# Altium schematic sheet Power_Card.SchDoc
size Letter; SheetNumber: 1; SheetTotal: 5
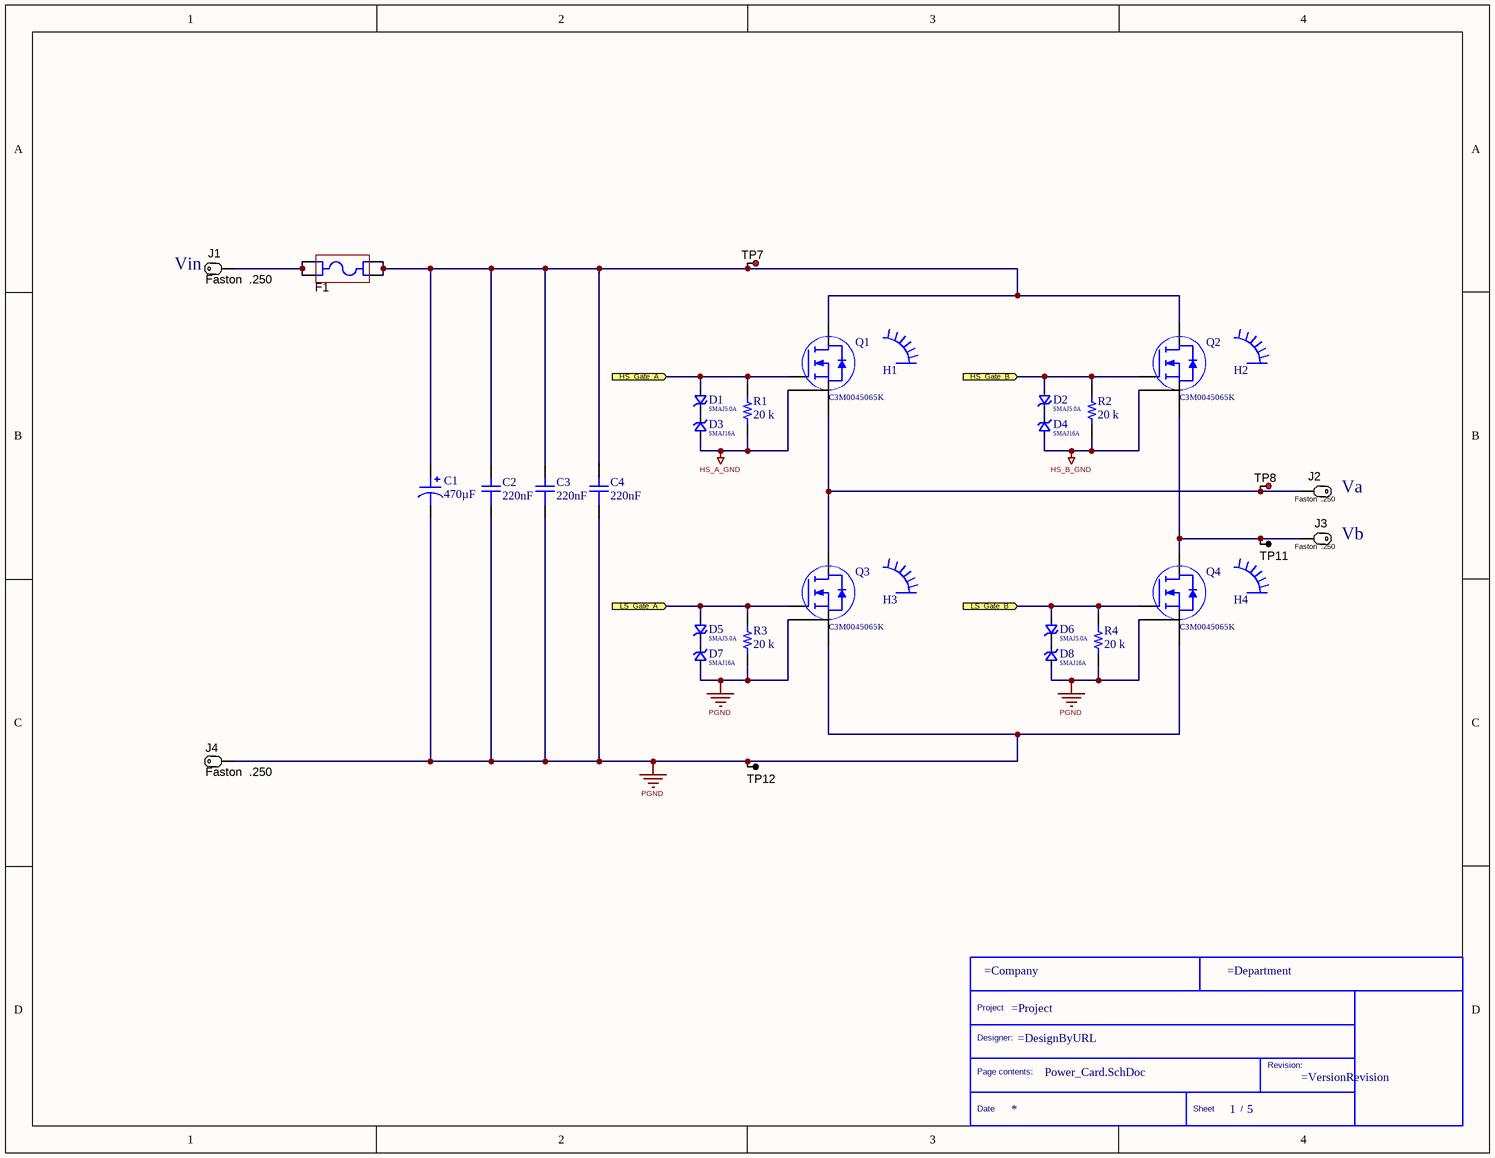
[diagram p0: Power_Card.SchDoc]

## Parts
*  TittleBlock  (value not drawn)  (graphical)
C1  470µF  [CAP TH ALUM ELEC D35.00mm S10.00mm H40.00mm]
C2  220nF  [R75PI32204030J]
C3  220nF  [R75PI32204030J]
C4  220nF  [R75PI32204030J]
D1  SMAJ5.0A  [DO214AC SMA]
D2  SMAJ5.0A  [DO214AC SMA]
D3  SMAJ16A  [DO214AC SMA]
D4  SMAJ16A  [DO214AC SMA]
D5  SMAJ5.0A  [DO214AC SMA]
D6  SMAJ5.0A  [DO214AC SMA]
D7  SMAJ16A  [DO214AC SMA]
D8  SMAJ16A  [DO214AC SMA]
F1  3101.0040  [SCHURTER_3101_0040]  (value not drawn)
H1  Disipador de 3.3.C/W  [HSINK_6399BG]  (value not drawn)
H2  Disipador de 3.3.C/W  [HSINK_6399BG]  (value not drawn)
H3  Disipador de 3.3.C/W  [HSINK_6399BG]  (value not drawn)
H4  Disipador de 3.3.C/W  [HSINK_6399BG]  (value not drawn)
J1  Faston  .250  [TE_62409-1]
J2  Faston  .250  [TE_62409-1]
J3  Faston  .250  [TE_62409-1]
J4  Faston  .250  [TE_62409-1]
Q1  C3M0045065K  [TO-247-4L_C3M0075120K_WFS]
Q2  C3M0045065K  [TO-247-4L_C3M0075120K_WFS]
Q3  C3M0045065K  [TO-247-4L_C3M0075120K_WFS]
Q4  C3M0045065K  [TO-247-4L_C3M0075120K_WFS]
R1  20 k  [RES 0603_1608]
R2  20 k  [RES 0603_1608]
R3  20 k  [RES 0603_1608]
R4  20 k  [RES 0603_1608]
TP7  5010  [Keystone5010]  (value not drawn)
TP8  5010  [Keystone5010]  (value not drawn)
TP11  5011  [Keystone5011]  (value not drawn)
TP12  5011  [Keystone5011]  (value not drawn)

## Ports
HS_Gate_A (in), HS_Gate_B (in), LS_Gate_A (in), LS_Gate_B (in)

## Nets
HS_A_GND: D3.2 Q1.3(S) R1.1
HS_B_GND: D4.2 Q2.3(S) R2.1
PGND: C1.2 C2.2 C3.2 C4.2 D7.2 D8.2 J4.1(P1) Q3.2(Power_Source) Q3.3(S) Q4.2(Power_Source) Q4.3(S) R3.1 R4.1 TP12.1
HS_Gate_A: D1.2 Q1.4(G) R1.2 ; port HS_Gate_A
HS_Gate_B: D2.2 Q2.4(G) R2.2 ; port HS_Gate_B
LS_Gate_A: D5.2 Q3.4(G) R3.2 ; port LS_Gate_A
LS_Gate_B: D6.2 Q4.4(G) R4.2 ; port LS_Gate_B
NetC1_1: C1.1 C2.1 C3.1 C4.1 F1.3 F1.4 Q1.1(D) Q2.1(D) TP7.1
NetD1_1: D1.1 D3.1
NetD2_1: D2.1 D4.1
NetD5_1: D5.1 D7.1
NetD6_1: D6.1 D8.1
NetF1_1: F1.1 F1.2 J1.1(P1)
NetJ2_1: J2.1(P1) Q1.2(Power_Source) Q3.1(D) TP8.1
NetJ3_1: J3.1(P1) Q2.2(Power_Source) Q4.1(D) TP11.1

## Notes on the sheet
- (near J1) Vin
- (near J2) Va
- Vb
- (in symbol TittleBlock) Project; Designer:; Page contents:; Revision:; Date; Sheet; /

## Library data of the parts
* = TittleBlock: Standard Title block
C1 = ESMQ451VSN471MA40S: CAP ALUM 470UF 20% 450V SNAP; Manufacturer: United Chemi-Con; Lifetime @ Temp.: 2000 Hrs @ 85°C; Polarization: Polar; Ripple Current @ High Frequency: 3.618A @ 50kHz; Ripple Current @ Low Frequency: 2.53A @ 120Hz; Part Number: ESMQ451VSN471MA40S; Applications: General Purpose; Capacitance: 470µF; ComponentLink1Description: Datasheet; ComponentLink1URL: http://www.chemi-con.co.jp/cgi-bin/CAT_DB/SEARCH/cat_db_al.cgi?e=e&j=p&pdfname=smqlug; ComponentLink2Description: DigiKey Link; ComponentLink2URL: http://digikey.com/product-detail/en/united-chemi-con/ESMQ451VSN471MA40S/565-2798-ND/758010; Device Package: Radial, Can - Snap-In; Height - Seated (Max): 1.575" (40.00mm); LastUpdated: 13/9/2020 09:22:08; Lead Spacing: 0.394" (10.00mm); Lifecycle Status: Active; Minimum Order: 1; Mounting Type: Through Hole; Operating Temperature: -25°C ~ 85°C; Package / Case: Radial, Can - Snap-In; Packaging: Bulk; PartId: 26446; Part Status: Active; Price: 5.99; Series: SMQ; Size / Dimension: 1.378" Dia (35.00mm); Supplier 1: DigiKey; Supplier Part Number 1: 565-2798-ND; Tolerance: ±20%; Value: 470µF; Voltage - Rated: 450V
C2-C4 = R75PI32204030J: KEMET         R75PI32204030J            Film Capacitor, AEC-Q200 R75 Series, 0.22 F,  5%, PP (Polypropylene), 630 V; Voltage Rating: 630V; Voltage Rating (AC): 250V; Dissipation Factor: 0.05%; Lead Diameter: 0.8mm; Lead Length: 30mm; Supplier 1: Digi-Key; Supplier Part Number 1: 399-12761-ND; Manufacturer: KEMET; Manufacturer Part Number: R75PI32204030J; RoHS: Yes; Category: Film Capacitors; Stock 1: 488; Pricing 1: 1=0,95000, 10=0,72000, 50=0,59800, 100=0,51490, 500=0,39860, 1000=0,34324, 2500=0,32110, 5000=0,31002 (USD); Mount: Through Hole; Case/Package: Radial; Dielectric Material: PP; Min Operating Temperature: -55°C; Max Operating Temperature: 105°C; Capacitance: 220nF; Tolerance: 5%; Packaging: Bulk; Voltage Rating (DC): 630V; Dielectric: PP; Termination: PC Pins; Voltage: 630V; Length: 0.709inch; Width: 0.394inch; Height: 16mm; Height - Seated (Max): 0.634inch; Lead Pitch: 15mm; Depth: 10mm; REACH SVHC: No SVHC; RoHS Compliant: Yes; ComponentLink1URL: http://www.alliedelec.com/m/d/0659d349de7ca29105b1b70da899f791.pdf?src-supplier=Allied+Electronics; ComponentLink1Description: http://www.alliedelec.com/m/d/0659d349de7ca29105b1b70da899f791.pdf?src-supplier=Allied+Electronics; ComponentLink2URL: http://www.farnell.com/datasheets/2120989.pdf?src-supplier=Farnell; ComponentLink2Description: http://www.farnell.com/datasheets/2120989.pdf?src-supplier=Farnell; ComponentLink3URL: http://www.kemet.com/docfinder?Partnumber=R75PI32204030J&src-supplier=Digi-Key; ComponentLink3Description: http://www.kemet.com/docfinder?Partnumber=R75PI32204030J&src-supplier=Digi-Key; ComponentLink4URL: http://www.farnell.com/datasheets/2068064.pdf?src-supplier=Element14; ComponentLink4Description: http://www.farnell.com/datasheets/2068064.pdf?src-supplier=Element14
D1 D2 D5 D6 = SMAJ5.0A: BOURNS - SMAJ5.0A - TVS Diode, SMAJ Series, Unidirectional, 5 V, 9.2 V, DO-214AC (SMA), 2 Pins; Max Power Dissipation: 400W; Number of Elements: 1; Max Surge Current: 40A; Reverse Breakdown Voltage: 6.4V; Breakdown Voltage: 7V; Reverse Standoff Voltage: 5V; Clamping Voltage: 9.2V; Test Current: 10mA; Peak Pulse Current: 43.5A; Element Configuration: Single; Leakage Current: 800uA; Operating Supply Voltage: 3.5V; Power Line Protection: No; Diode Type: ZENER; ESD Protection: Yes; Supplier 1: Digi-Key; Supplier Part Number 1: SMAJ5.0ABCT-ND; Manufacturer: Bourns; Manufacturer Part Number: SMAJ5.0A; RoHS: Yes; Category: TVS Diodes; Stock 1: 30981; Pricing 1: 1=0,49000, 10=0,34300, 100=0,17320, 500=0,14130, 1000=0,10483, 2000=0,08820 (USD); Mount: Surface Mount; Case/Package: DO-214AC; Number of Pins: 2; Min Operating Temperature: -55°C; Max Operating Temperature: 150°C; Packaging: Tape and Reel; Package Quantity: 1; Series: SMAJ; Polarity: Unidirectional; Direction: Unidirectional; Peak Pulse Power: 400W; Min Breakdown Voltage: 6.4V; Number of Channels: 1; Max Reverse Leakage Current: 800uA; Termination: SMD/SMT; Max Breakdown Voltage: 7V; Number of Unidirectional Channels: 1; Resistor Type: Zener; Length: 4.57mm; Width: 2.92mm; Height: 2.42mm; Radiation Hardening: No; RoHS Compliant: Yes; REACH SVHC: No SVHC; ComponentLink1URL: https://datasheet.ciiva.com/25624/0900766b8112213b-25624680.pdf?src-supplier=RSComponents; ComponentLink1Description: https://datasheet.ciiva.com/25624/0900766b8112213b-25624680.pdf?src-supplier=RSComponents; ComponentLink2URL: https://datasheet.ciiva.com/333/smaj-333521.pdf?src-supplier=Digi-Key; ComponentLink2Description: https://datasheet.ciiva.com/333/smaj-333521.pdf?src-supplier=Digi-Key; ComponentLink3URL: https://datasheet.ciiva.com/333/smaj-333522.pdf?src-supplier=Digi-Key; ComponentLink3Description: https://datasheet.ciiva.com/333/smaj-333522.pdf?src-supplier=Digi-Key; ComponentLink4URL: https://datasheet.ciiva.com/333/smaj-333523.pdf?src-supplier=Digi-Key; ComponentLink4Description: https://datasheet.ciiva.com/333/smaj-333523.pdf?src-supplier=Digi-Key; ComponentLink5URL: https://datasheet.ciiva.com/3021/smaj-3021400.pdf?src-supplier=Avnet; ComponentLink5Description: https://datasheet.ciiva.com/3021/smaj-3021400.pdf?src-supplier=Avnet; ComponentLink6URL: https://datasheet.ciiva.com/30169/smaj-30169929.pdf?src-supplier=Onlinecomponents.com; ComponentLink6Description: https://datasheet.ciiva.com/30169/smaj-30169929.pdf?src-supplier=Onlinecomponents.com; ComponentLink7URL: https://datasheet.ciiva.com/28409/1695388-28409916.pdf?src-supplier=Element14; ComponentLink7Description: https://datasheet.ciiva.com/28409/1695388-28409916.pdf?src-supplier=Element14
D3 D4 D7 D8 = SMAJ16A: TVS DIODE 16VWM 26VC DO214AC; Manufacturer: Bourns; Clamping Voltage: 26V; Peak Pulse Power: 400W; Reverse Standoff Voltage: 16V; Peak Pulse Current: 15.3A; Polarity: Unidirectional; Test Current: 1mA; Min Breakdown Voltage: 17.8V; Max Surge Current: 40A; Breakdown Voltage: 19.7V; Operating Supply Voltage: 3.5V; Number of Channels: 1; Leakage Current: 5uA; Element Configuration: Single; Power Line Protection: No; Diode Type: ZENER; Supplier 1: Digi-Key; Supplier Part Number 1: SMAJ16ABCT-ND; Manufacturer Part Number: SMAJ16A; RoHS: Yes; Category: TVS Diodes; Stock 1: 14121; Pricing 1: 1=0,49000, 10=0,34400, 100=0,17360, 500=0,14160, 1000=0,10505, 2000=0,08838 (USD); Mount: Surface Mount; Case/Package: DO-214AC; Number of Pins: 2; Min Operating Temperature: -55°C; Max Operating Temperature: 150°C; Packaging: Tape and Reel; Package Quantity: 1; Direction: Unidirectional; Reverse Breakdown Voltage: 17.8V; Number of Elements: 1; Termination: SMD/SMT; Max Reverse Leakage Current: 5uA; Number of Unidirectional Channels: 1; Series: SMAJ; Max Power Dissipation: 400W; Resistor Type: Zener; Max Breakdown Voltage: 19.7V; Radiation Hardening: No; RoHS Compliant: Yes; REACH SVHC: No SVHC; ComponentLink1URL: https://datasheet.ciiva.com/3022/smaj-3022194.pdf?src-supplier=Avnet; ComponentLink1Description: https://datasheet.ciiva.com/3022/smaj-3022194.pdf?src-supplier=Avnet; ComponentLink2URL: https://datasheet.ciiva.com/3022/smaj-3022195.pdf?src-supplier=Avnet; ComponentLink2Description: https://datasheet.ciiva.com/3022/smaj-3022195.pdf?src-supplier=Avnet; ComponentLink3URL: https://datasheet.ciiva.com/8031/1695388-8031131.pdf?src-supplier=Element14; ComponentLink3Description: https://datasheet.ciiva.com/8031/1695388-8031131.pdf?src-supplier=Element14; ComponentLink4URL: https://datasheet.ciiva.com/28649/1695388-28649163.pdf?src-supplier=Element14; ComponentLink4Description: https://datasheet.ciiva.com/28649/1695388-28649163.pdf?src-supplier=Element14; ComponentLink5URL: https://datasheet.ciiva.com/333/smaj-333452.pdf?src-supplier=Digi-Key; ComponentLink5Description: https://datasheet.ciiva.com/333/smaj-333452.pdf?src-supplier=Digi-Key; ComponentLink6URL: https://datasheet.ciiva.com/333/smaj-333453.pdf?src-supplier=Digi-Key; ComponentLink6Description: https://datasheet.ciiva.com/333/smaj-333453.pdf?src-supplier=Digi-Key; ComponentLink7URL: https://datasheet.ciiva.com/17413/smaj-17413677.pdf?src-supplier=Avnet+Europe; ComponentLink7Description: https://datasheet.ciiva.com/17413/smaj-17413677.pdf?src-supplier=Avnet+Europe; ComponentLink8URL: https://datasheet.ciiva.com/333/smaj-333454.pdf?src-supplier=Digi-Key; ComponentLink8Description: https://datasheet.ciiva.com/333/smaj-333454.pdf?src-supplier=Digi-Key; ComponentLink9URL: https://datasheet.ciiva.com/16237/smaj-16237406.pdf?src-supplier=Onlinecomponents.com; ComponentLink9Description: https://datasheet.ciiva.com/16237/smaj-16237406.pdf?src-supplier=Onlinecomponents.com
F1 = 3101.0040: Fuse Holder, 400 V, 16 A, TH; Manufacturer: Schurter; SymbolCreator: a0799628; SymbolVersion: 2014-05-01; CompType: Fuse Holder; PartNumber: 3101.0040; RoHS: Y; PackageReference: Fuse Holder for 5x20mm; MountType: TH; ComponentLink1Description: Datasheet Link; ComponentLink1URL: http://www.schurterinc.com/var/schurter/storage/ilcatalogue/files/document/datasheet/en/pdf/typ_FPG4.pdf; Publisher: Texas Instruments; LatestRevisionDate: 2016-05-10; Supplier 1: Digi-Key; Supplier Part Number 1: 486-1159-ND; Supplier 2: Mouser; Supplier Part Number 2: 693-3101.0040; Supplier 3: Farnell; Supplier Part Number 3: 1222690
H1-H4 = 6399BG: AAVID THERMALLOY         6399BG            Heat Sink, TO-220/218, TO-220, 3.3 C/W, 50 mm, 41.91 mm, 25.4 mm; Finish: Anodized; Natural Thermal Resistance: 3.3°C/W; Supplier 1: Digi-Key; Supplier Part Number 1: HS528-ND; Manufacturer: Aavid Thermalloy; Manufacturer Part Number: 6399BG; RoHS: Yes; Category: Heat Sinks; Stock 1: 1442; Pricing 1: 1=6,20000, 10=6,02800, 25=5,69320, 50=5,35840, 100=5,02350, 250=4,68860, 500=4,35370, 1000=4,26998, 5000=4,18625 (USD); Case/Package: TO-220; Color: Black; Material: Anodized; Type: Passive; Package Quantity: 250; Series: *; Length: 41.91mm; Width: 41.91mm; Height: 50.8mm; Depth: 25.4mm; Radiation Hardening: No; REACH SVHC: No SVHC; Lead Free: Lead Free; RoHS Compliant: Yes; ComponentLink1URL: https://datasheet.ciiva.com/26826/getdatasheetpartid-556672-26826808.pdf?src-supplier=Verical; ComponentLink1Description: https://datasheet.ciiva.com/26826/getdatasheetpartid-556672-26826808.pdf?src-supplier=Verical; ComponentLink2URL: https://datasheet.ciiva.com/16401/aavid20thermalloy206399bg-16401195.pdf?src-supplier=Future+Electronics; ComponentLink2Description: https://datasheet.ciiva.com/16401/aavid20thermalloy206399bg-16401195.pdf?src-supplier=Future+Electronics
J1-J4 = 62409-1: Quick Disconnect Terminal M 15.8mm 7.5mm Tin Over Copper Automotive Bag; Manufacturer: AMP - TE CONNECTIVITY; Supplier 1: Digi-Key; Supplier Part Number 1: A24742-ND; Manufacturer Part Number: 62409-1; RoHS: No; Stock 1: 8729; Pricing 1: 1=0,19000, 10=0,17800, 25=0,15200, 50=0,13320, 100=0,12360, 250=0,10936, 750=0,09035, 1500=0,08083, 8000=0,06895 (USD); ComponentLink1URL: http://www.farnell.com/datasheets/1650963.pdf?src-supplier=Farnell; ComponentLink1Description: http://www.farnell.com/datasheets/1650963.pdf?src-supplier=Farnell; ComponentLink2URL: http://www.farnell.com/datasheets/1650963.pdf?src-supplier=Element14; ComponentLink2Description: http://www.farnell.com/datasheets/1650963.pdf?src-supplier=Element14; ComponentLink3URL: http://www.farnell.com/datasheets/1650963.pdf?src-supplier=Newark; ComponentLink3Description: http://www.farnell.com/datasheets/1650963.pdf?src-supplier=Newark; ComponentLink4URL: https://www.te.com/commerce/DocumentDelivery/DDEController?Action=srchrtrv&DocNm=62409&DocType=Customer+Drawing&DocLang=English&src-supplier=Digi-Key; ComponentLink4Description: https://www.te.com/commerce/DocumentDelivery/DDEController?Action=srchrtrv&DocNm=62409&DocType=Customer+Drawing&DocLang=English&src-supplier=Digi-Key
Q1-Q4 = C3M0045065K: Sic MOSFET 650V; Manufacturer: Cree Wolfspeed; Supplier 1: Digi-Key; Supplier Part Number 1: 1697-C3M0045065K-ND; Manufacturer Part Number: C3M0045065K; RoHS: No; Stock 1: 444; Pricing 1: 1=10,55000 (USD)
R1-R4 = RC0603FR-0720KL: RES SMD 20K OHM 1% 1/10W 0603; Manufacturer: Yageo; Power (Watts): 0.1W, 1/10W; Resistance: 20 kOhms; Temperature Coefficient: ±100ppm/°C; Part Number: RC0603FR-0720KL; Value: 20 k; ComponentLink1Description: Datasheet; ComponentLink1URL: https://www.yageo.com/upload/media/product/productsearch/datasheet/rchip/PYu-RC_Group_51_RoHS_L_10.pdf; ComponentLink2Description: DigiKey Link; ComponentLink2URL: http://digikey.com/product-detail/en/yageo/RC0603FR-0720KL/311-20.0KHRCT-ND/729987; Composition: Thick Film; Device Package: 0603 (1608 Metric); Features: Moisture Resistant; Height - Seated (Max): 0.022" (0.55mm); LastUpdated: 2/9/2020 01:09:40; Lifecycle Status: Active; Minimum Order: 1; Number of Terminations: 2; Operating Temperature: -55°C ~ 155°C; Package / Case: 0603 (1608 Metric); Packaging: CutTape; PartId: 23954; Part Status: Active; Price: 0.10; Series: RC; Size / Dimension: 0.063" L x 0.031" W (1.60mm x 0.80mm); Supplier 1: DigiKey; Supplier Part Number 1: 311-20.0KHRCT-ND; Supplier Device Package: 0603; Tolerance: ±1%
TP7 TP8 = 5010: Test Point, Multipurpose, Red, TH; Manufacturer: Keystone; CompType: Test Point Loop; ContactFinish: Silver; SymbolVersion: 2008-04-04; PartNumber: 5010; PackageReference: Red Multipurpose Testpoint; RoHS: Y; MountType: TH; ComponentLink1Description: Datasheet URL; ComponentLink1URL: http://www.keyelco.com/userAssets/file/M60-2p60.pdf; Color: Red; Publisher: Texas Instruments; LatestRevisionDate: 2016-02-11; Supplier 1: Digi-Key; Supplier Part Number 1: 36-5010-ND; Supplier 2: Mouser; Supplier Part Number 2: 534-5010
TP11 TP12 = 5011: Test Point, Multipurpose, Black, TH; Manufacturer: Keystone; CompType: Test Point Loop; ContactFinish: Silver; SymbolVersion: 2008-04-04; PartNumber: 5011; PackageReference: Black Multipurpose Testpoint; RoHS: Y; MountType: TH; ComponentLink1Description: Datasheet URL; ComponentLink1URL: http://www.keyelco.com/userAssets/file/M60-2p60.pdf; Color: Black; Publisher: Texas Instruments; LatestRevisionDate: 2016-02-11; Supplier 1: Digi-Key; Supplier Part Number 1: 36-5011-ND; Supplier 2: Mouser; Supplier Part Number 2: 534-5011